# Altium schematic sheet Sheet1.SchDoc
size A4
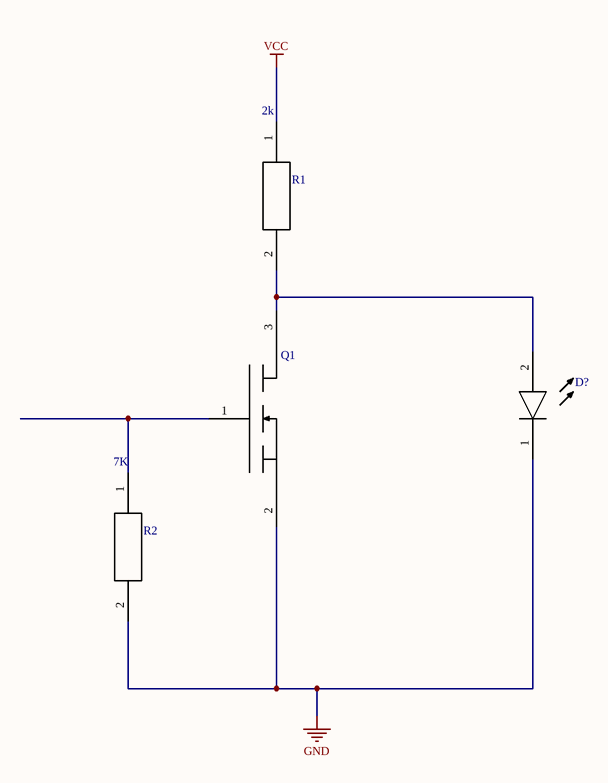
[diagram p0: Sheet1.SchDoc]

## Parts
D?  DIODE  [DIODE]  (value not drawn)
Q1  TRANSISTOR  [TRANSISTOR]  (value not drawn)
R1  value 2k  [Resistor]  (hidden comment: RESISTOR)
R2  value 7K  [Resistor]  (hidden comment: RESISTOR)

## Nets

Not connected (* = marked no-connect by the designer): D? 1 2; Q1 1 2 3; R1 1 2; R2 1 2

## Library data of the parts
Q1 = TRANSISTOR: nMOS
R1 = RESISTOR: Part Number: 100; Component: RESISTOR; Library Path: Schematic Components.SchLib; Library Ref: RESISTOR
R2 = RESISTOR: Part Number: 200; Component: RESISTOR; Library Path: Schematic Components.SchLib; Library Ref: RESISTOR